# EAGLE design PrechargeV3 (EAGLE 9.1.3)
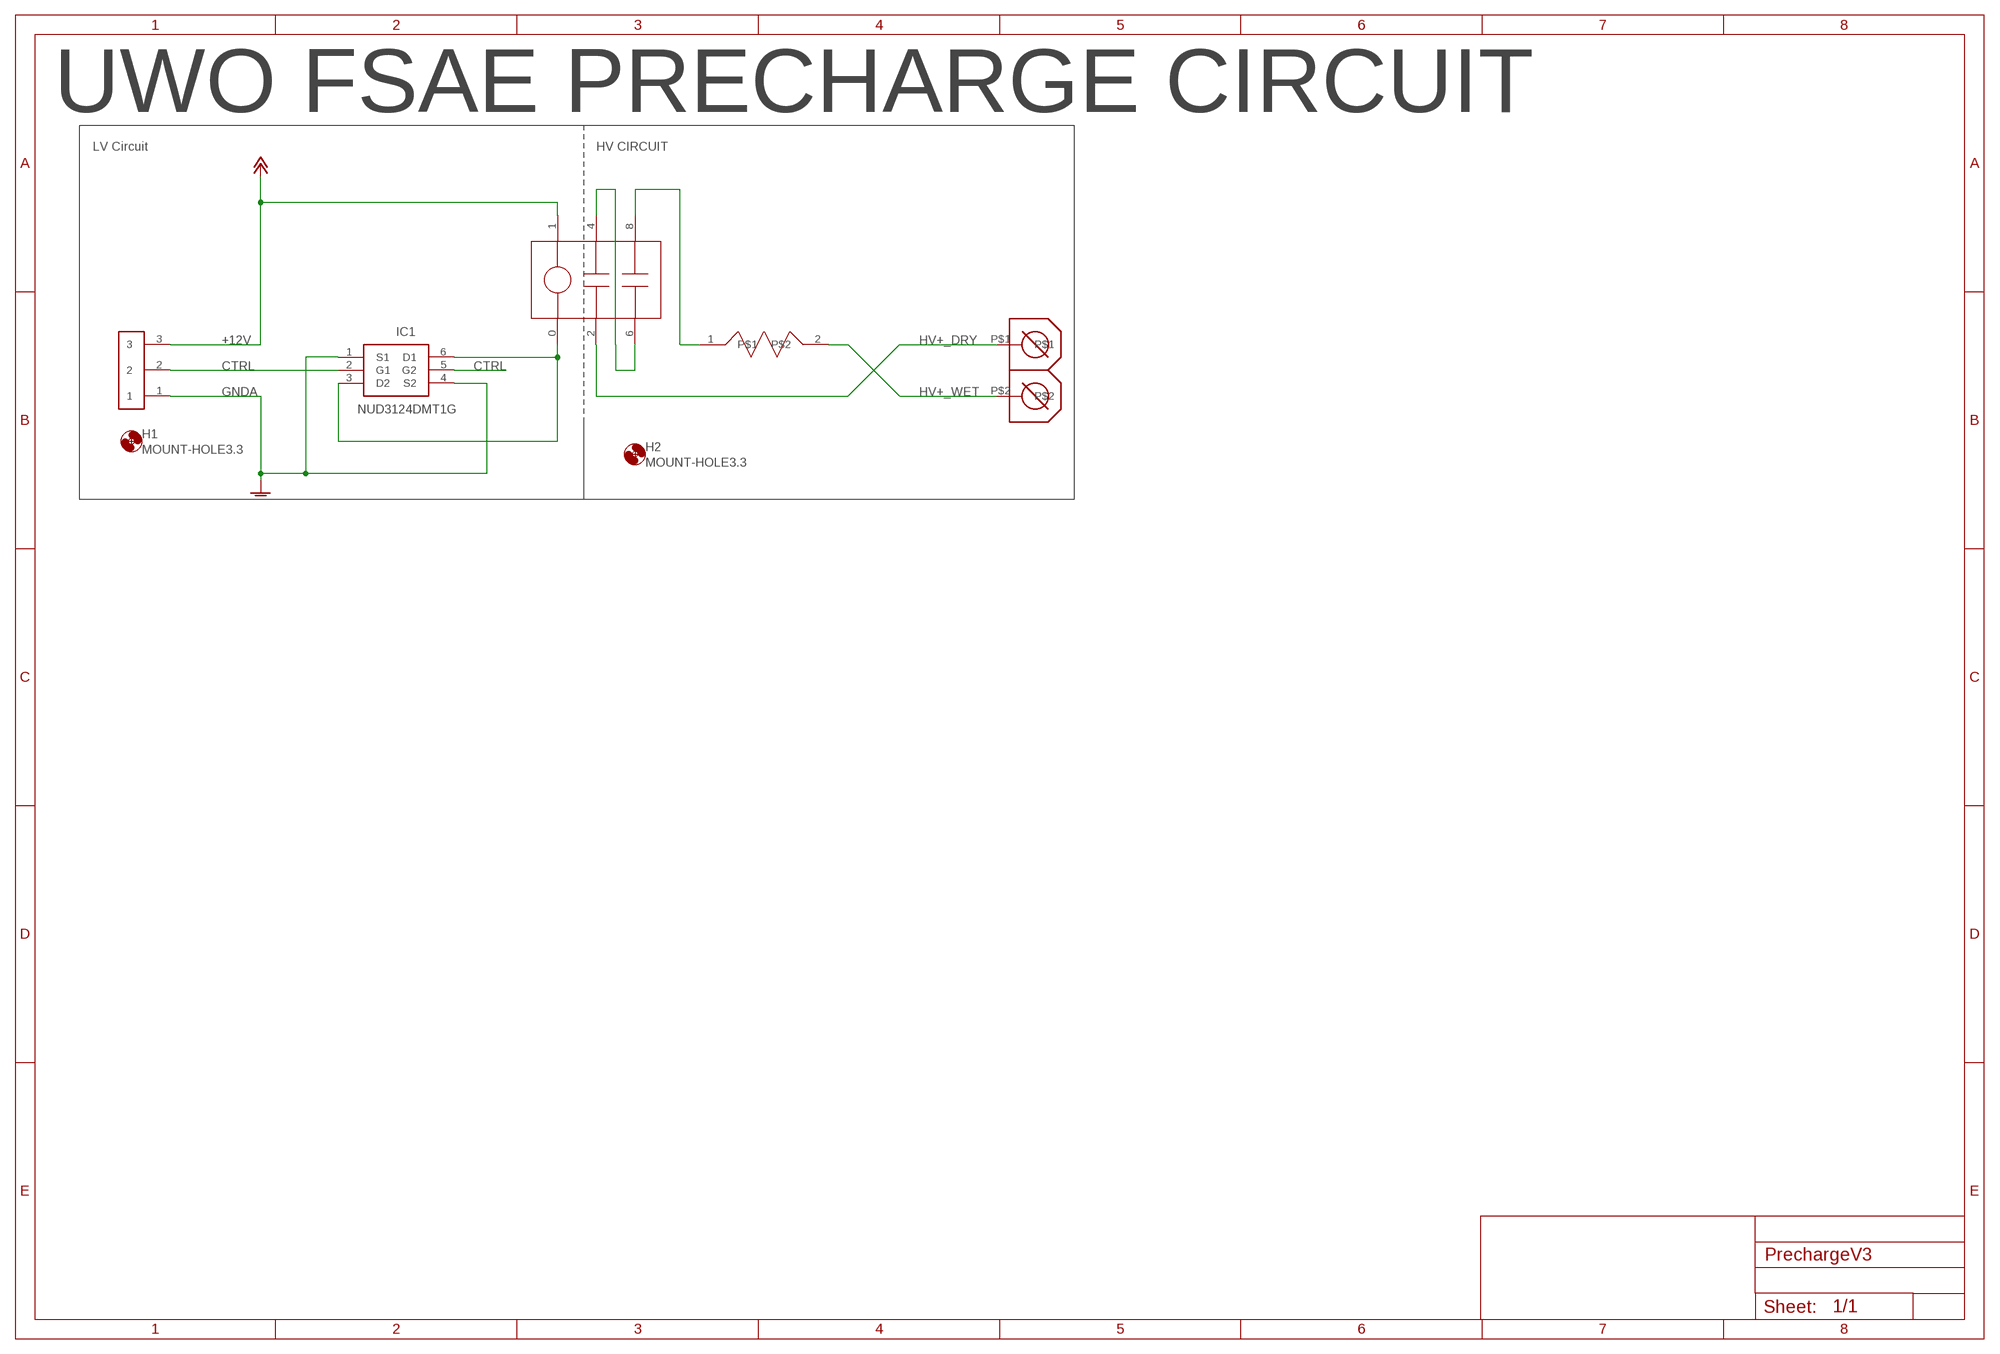
[diagram p0: schematic, sheet 1]

## Parts
H1  MOUNT-HOLE3.3  [3,3]
H2  MOUNT-HOLE3.3  [3,3]
IC1  NUD3124DMT1G  SAMACSYS_PARTS_NUD3124DMT1G  [SAMACSYS_PARTS_SOT95P275X110-6N]
U$1  TO247RESISTORHEATINK  [_CUSTOM_TO-247-2V]
U$2  PHOENIX_1935789  [PHOENIX_1935789]
U$3  G7L  [G7L]
U$17  282838-2_TE  [282838-2_FOOT]

## Nets
+12V [LV]: U$2.3 U$3.1
CTRL [LV]: IC1.2(G1) IC1.5(G2) U$2.2
GNDA [LV]: IC1.1(S1) IC1.4(S2) U$2.1
HV+_DRY: U$3.2 U$17.P$1
HV+_WET: U$1.2 U$17.P$2
N$2: U$1.1 U$3.8
N$3: U$3.4 U$3.6
N$4 [LV]: IC1.3(D2) IC1.6(D1) U$3.0

## Notes on the sheet
- UWO FSAE PRECHARGE CIRCUIT
- LV Circuit | HV CIRCUIT

## Library data of the parts
H1 H2 = holes:MOUNT-HOLE: MOUNTING HOLE with drill center marker
IC1 = _CUSTOM:SAMACSYS_PARTS_NUD3124DMT1G: Automotive Inductive Load Driver Source: Datasheet <https://componentsearchengine.com/Datasheets/1/NUD3124DMT1G.pdf>; DESCRIPTION: Automotive Inductive Load Driver; HEIGHT: 1.1mm; MANUFACTURER_NAME: ON Semiconductor; MANUFACTURER_PART_NUMBER: NUD3124DMT1G; MOUSER_PART_NUMBER: 863-NUD3124DMT1G
U$1 = 111:TO247RESISTORHEATINK
U$2 = _CUSTOM:PHOENIX_1935789
U$3 = precharge:G7L
U$17 = DCDC_Parts:282838-2_TE

## Net classes
0 default: clearance 2 mm
1 LV: clearance 0.001 mm

## Board
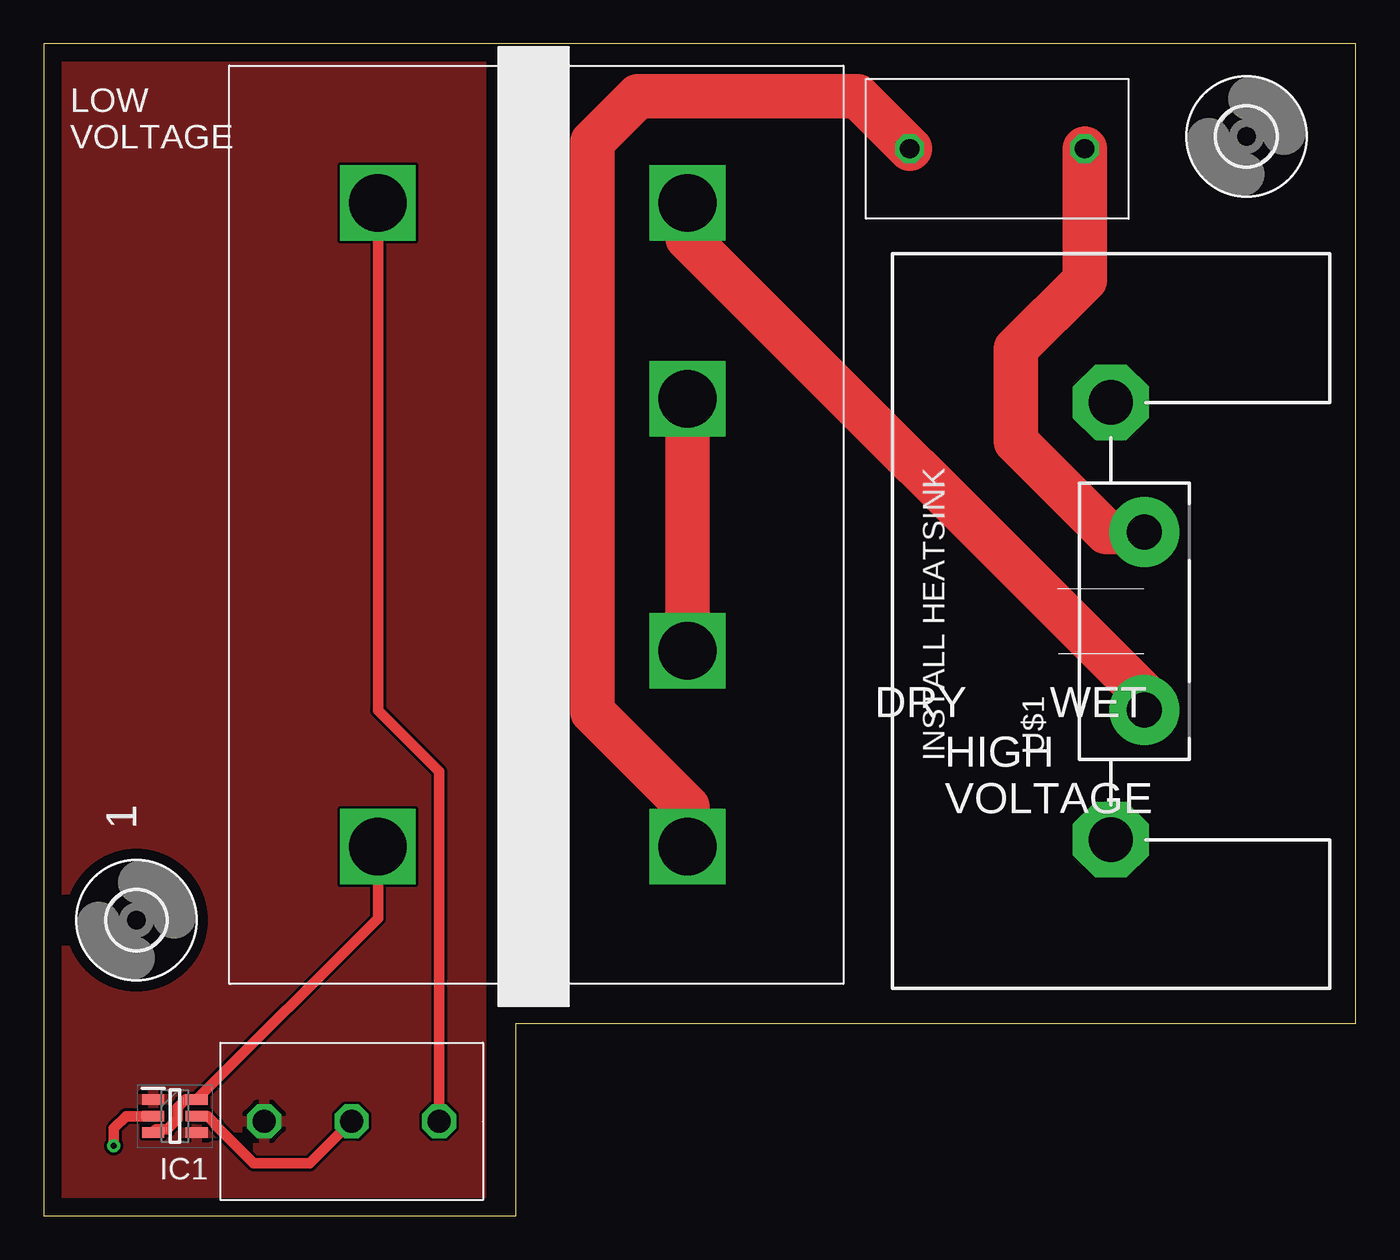
[diagram p1: board, top side]
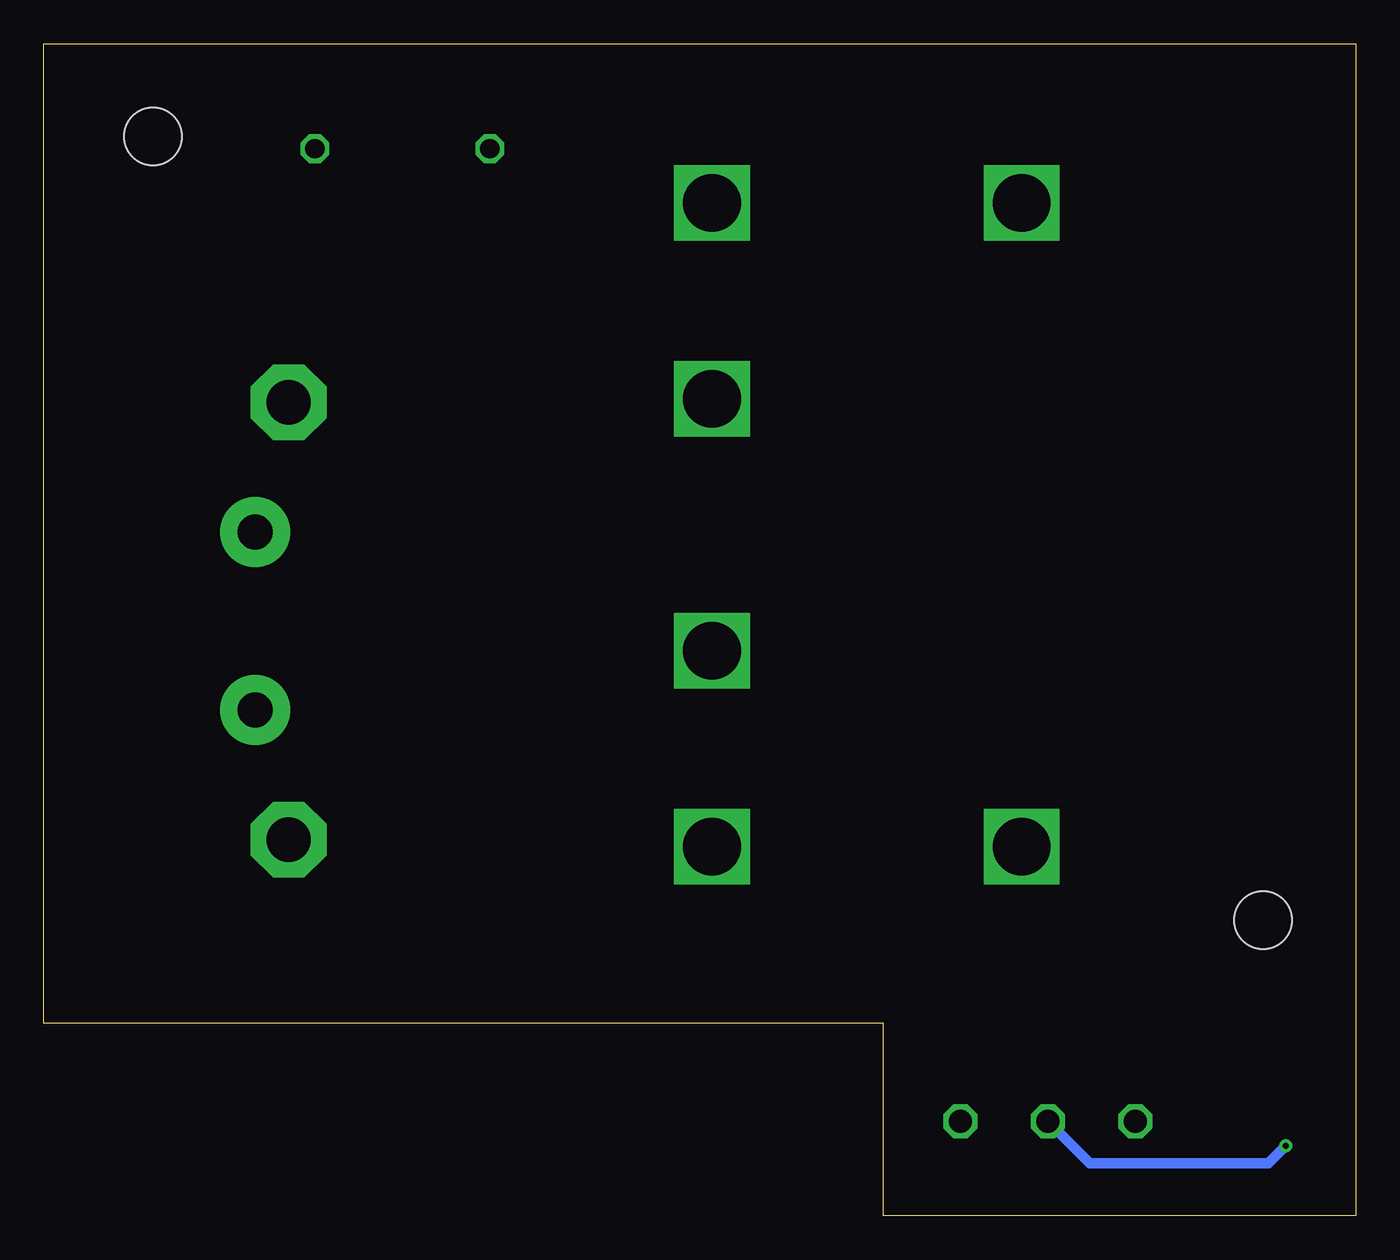
[diagram p2: board, bottom side, seen from below]

Size 75 x 67 mm. Coordinates in mm from the lower left corner, seen from the top.
Outline: 0,0 27,0 27,11 75,11 75,67 0,67 0,0
Copper layers (1*16): Top 0.035mm / dielectric 1.5mm / Bottom 0.035mm
Design rules "default": minimum track width 6mil, minimum drill 0.35mm, track to track 6mil, track to pad 6mil, pad to pad 6mil, via to via 6mil, smd to smd 6mil, copper to edge 40mil, drill to drill 6mil, minimum pad ring 10mil, minimum via ring 8mil, stop-mask expansion 4mil, vias tented up to drill 0mil, thermal gap 10mil

### Footprints (pad centres in the part's own frame; a part is rotated, then mirrored left to right if it is on the bottom)
3,3 = hole 3.3: 0,0
SAMACSYS_PARTS_SOT95P275X110-6N = smd 1.25 x 0.6: 1 -1.25,0.95; 2 -1.25,0; 3 -1.25,-0.95; 4 1.25,-0.95; 5 1.25,0; 6 1.25,0.95
_CUSTOM_TO-247-2V = drill 2 pad 4: 1 -5.08,-1.905; 2 5.08,-1.905 | drill 2.54 pad 4.318 octagon: P$1 -12.5,0; P$2 12.5,0
PHOENIX_1935789 = drill 1.3 octagon: 1 0,0; 2 5,0; 3 10,0
G7L = drill 3.3 square: 0 0,0; 1 36.8,0; 2 0,-17.7; 4 11.2,-17.7; 6 25.6,-17.7; 8 36.8,-17.7
282838-2_FOOT = drill 1.1 octagon: P$1 0,0; P$2 10,0

### Placement (x,y rotation side)
H1  5.3,16.9 0 top
H2  68.75,61.7 0 top
IC1  7.5,5.7 0 top
U$1  61,34 90 top
U$2  12.6,5.4 0 top
U$3  19.1,21.1 90 top
U$17  49.5,61 0 top

### Tracks (layer width: path | path; a pad name or v marks a point on that pad's centre or on a via)
+12V
  Top 0.61: U$3.1 19.1,28.9 22.6,25.4 U$2.3
CTRL  (via drill 0.35)
  Top 0.61: IC1.2 4.7,5.7 4,5 v4,4 | IC1.5 9.37,5.7 9.83,5.24 9.83,5.17 12,3 15.2,3 U$2.2
  Bottom 0.61: U$2.2 15.2,3 5,3 v4,4
GNDA
  pour Top: 0,0 25,0 25,67 0,67
HV+_DRY
  Top 2.54: U$3.2 36.8,23.36 31.37,28.79 31.37,61.41 33.96,64 46.5,64 U$17.P$1
HV+_WET
  Top 2.54: U$17.P$2 59.5,53.5 55.57,49.57 55.57,44.25 60.74,39.08 U$1.2
N$2
  Top 2.54: U$3.8 36.8,55.9 62.91,29.8 U$1.1
N$3
  Top 2.54: U$3.6 U$3.4
N$4
  Top 0.61: U$3.0 19.1,17 IC1.6 8.13,6.65 7.67,6.19 7.67,5.55 7.06,4.94 6.44,4.94 IC1.3

### Text on the board
tPlace: LOW / VOLTAGE | DRY | WET | HIGH / VOLTAGE | 1
Measures: HEAT SINK FOR RESISTOR | PRECHARGE RELAY | INDUCTIVE DRIVER IC